# EAGLE design tweeq-eMod_PiezoBuzzer (EAGLE 7.2.0)
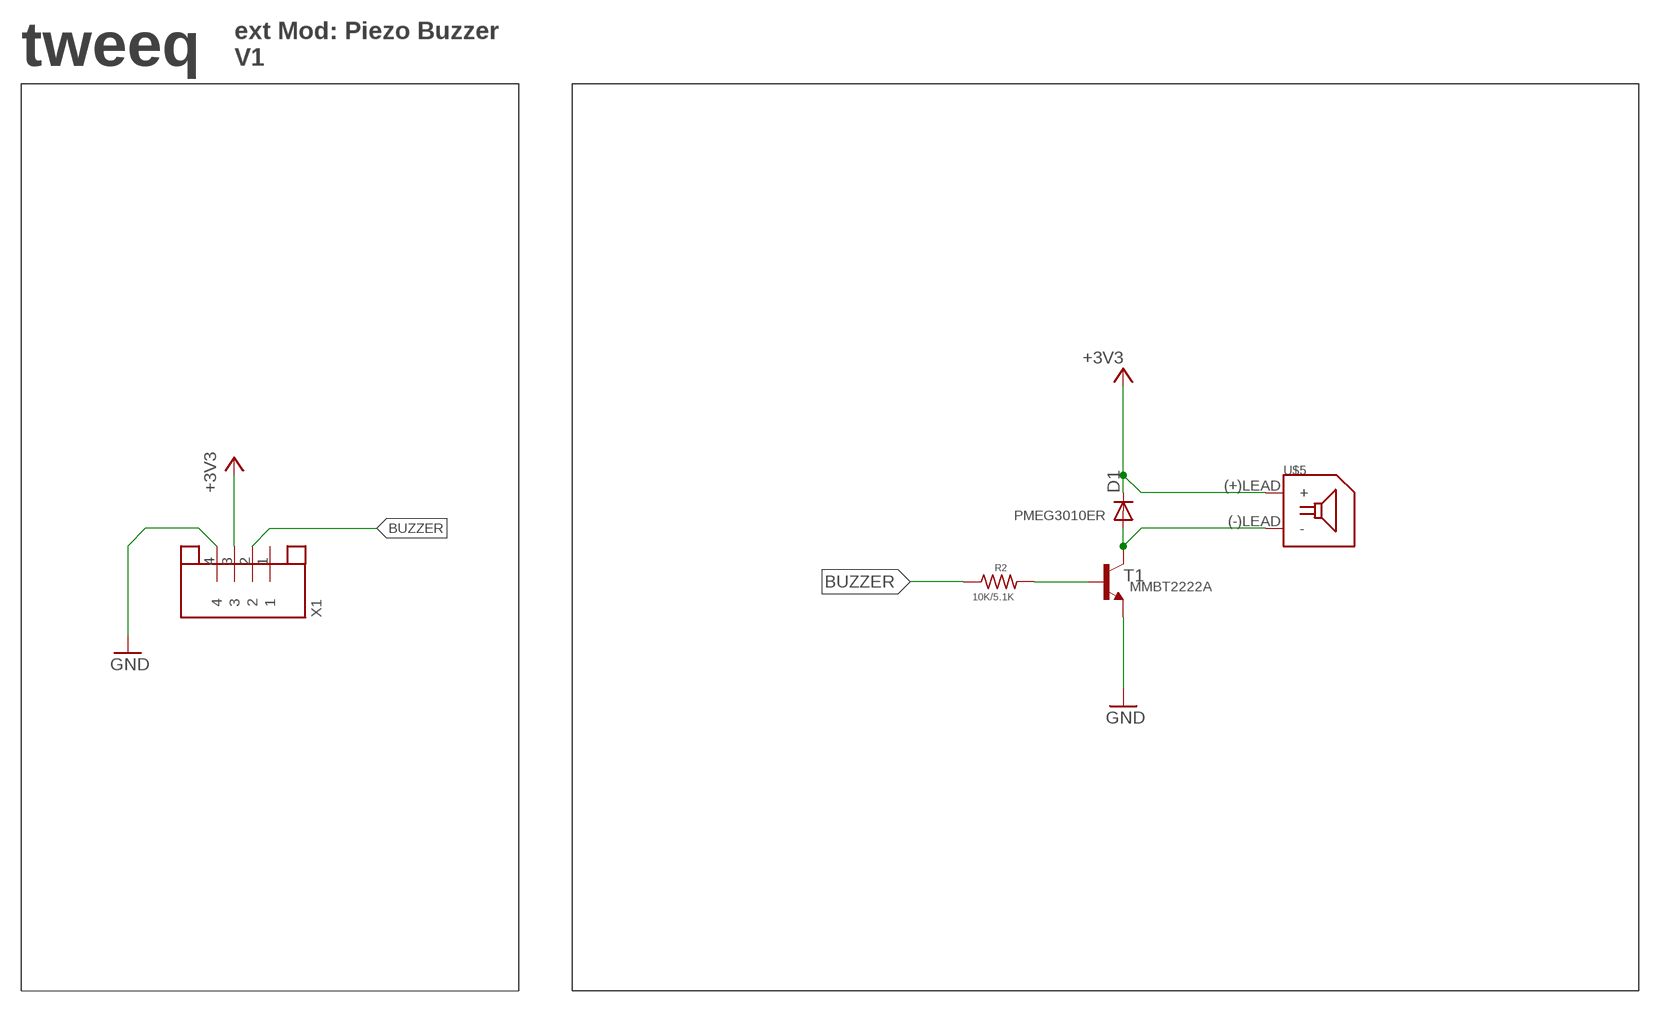
[diagram p0: schematic, sheet 1]

## Parts
D1  PMEG3010ER  PMEG3010ER/MOD  [SOD123-MOD]
R2  10K/5.1K  R-US_R0402  [R0402]
T1  2N3904MMBT3904  [SOT23-3]
U$5  SMD_PEIZO_BUZZER-DET  [DET801J-13-G]
X1  JST-4PINSH  [SH1.0-4PIN]

## Nets
+3V3: D1.C U$5.(+)LEAD(+) X1.3
BUZZER: R2.1 X1.2
GND: T1.2(E) X1.4
N$9: R2.2 T1.1(B)
N$10: D1.A T1.3(C) U$5.(-)LEAD(-)
Unconnected: X1.1

## Notes on the sheet
- tweeq
- ext Mod: Piezo Buzzer
  V1
- PMEG3010ER
- MMBT2222A

## Library data of the parts
D1 = AISCube:PMEG3010ER: Schottky Barrier Rectiﬁer PMEG3010ER 1 A low VF MEGA Schottky barrier rectiﬁer
R2 = rcl:R-US_: RESISTOR, American symbol
T1 = AISCube:2N3904: NPN TRANSISTOR
U$5 = AISCube:SMD_PEIZO_BUZZER: SMD Piezo Buzzer
X1 = AISCube:JST-4PIN: JST 4 Pin

## Board
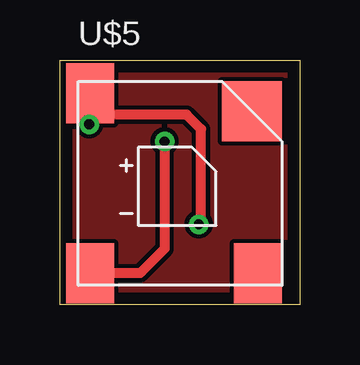
[diagram p1: board, top side]
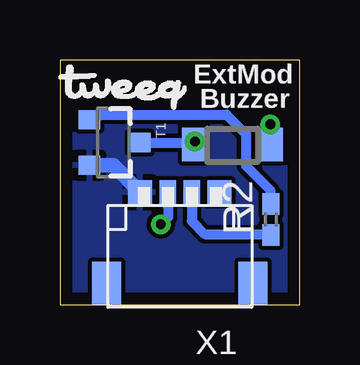
[diagram p2: board, bottom side, seen from below]

Size 10 x 10.2 mm. Coordinates in mm from the lower left corner, seen from the top.
Outline: 0,10.2 10,10.2 10,0 0,0 0,10.2
Copper layers (1*16): Top 0.0356mm / dielectric 1.5011mm / Bottom 0.0356mm
Design rules "AISCube": minimum track width 7mil, minimum drill 14mil, track to track 7mil, track to pad 7mil, pad to pad 7mil, via to via 7mil, smd to smd 0mil, copper to edge 20mil, drill to drill 8mil, minimum pad ring 10mil, minimum via ring 8mil, stop-mask expansion 4mil, vias tented up to drill 32mil, thermal gap 10mil

### Footprints (pad centres in the part's own frame; a part is rotated, then mirrored left to right if it is on the bottom)
SOD123-MOD = smd 1 x 1.4: A 1.5,-0.035; C -1.7,-0.035
R0402 = smd 0.9 x 0.7: 1 -0.65,0; 2 0.65,0
SOT23-3 = smd 0.8 x 0.9: 1 -0.95,-1; 2 0.95,-1; 3 0,1.1
DET801J-13-G = smd 2 x 2.5: (+)LEAD 0.5,8; (-)LEAD 0.5,0.5; P$3 7.5,0.5 | smd 2.5 x 2.5: P$4 7.25,7.25
SH1.0-4PIN = smd 1 x 1: 1 -1.65,-0.55; 4 1.65,-0.55 | smd 0.7 x 1: 2 -0.5,-0.55; 3 0.5,-0.55 | smd 1.2 x 1.8: P$1 -3.05,3.25; P$2 3.05,3.25

### Placement (x,y rotation side)
D1  2.9,6.64 180 bottom
R2  1.19,3.56 90 bottom
T1  7.77,6.76 270 bottom
U$1  [TWEEQ-LOGO-S]  10.06,8.13 0 bottom
U$5  0.76,0.8 0 top
X1  5,4.14 180 bottom

### Tracks (layer width: path | path; a pad name or v marks a point on that pad's centre or on a via)
+3V3  (via drill 0.41)
  Top 0.406: 1.26,8.13 1.47,7.92 5.28,7.92 5.89,7.32 5.89,3.45 v5.79,3.35
  Top 0.61: U$5.(+)LEAD 1.26,8.13 1.26,7.56 v1.22,7.52
  Bottom 0.406: 5.49,4.68 5.49,3.66 v5.79,3.35
  Bottom 0.61: 5.49,4.68 X1.3 | v1.22,7.52 1.22,6.7 D1.C
BUZZER
  Bottom 0.406: X1.2 4.5,3.48 3.96,2.95 1.23,2.95 R2.1
GND
  Bottom 0.61: X1.4 7.77,5.81 T1.2
  pour Top: 9.8,10 9.8,0.18 0.15,0.18 0.15,10
  pour Bottom: 9.8,0.18 9.8,10 0.15,10 0.15,0.18
N$9
  Bottom 0.406: T1.1 8.54,7.71 8.33,7.92 3.05,7.92 2.23,7.11 2.23,5.79 1.22,4.78 1.22,4.23 R2.2
N$10  (via drill 0.41)
  Top 0.406: v4.37,6.81 4.37,2.34 3.35,1.32 1.28,1.32
  Top 0.61: 1.28,1.32 U$5.(-)LEAD
  Bottom 0.406: T1.3 4.48,6.76
  Bottom 0.61: 4.48,6.76 D1.A 4.4,6.78 v4.37,6.81

### Text on the board
bPlace: ExtMod | Buzzer
tNames: 6V-9V DC | ON
bNames: Breadboard | V-Reg | Module